# EAGLE design RF (EAGLE 9.6.2)

## Sheet 1 of 3: Board to Board Headers
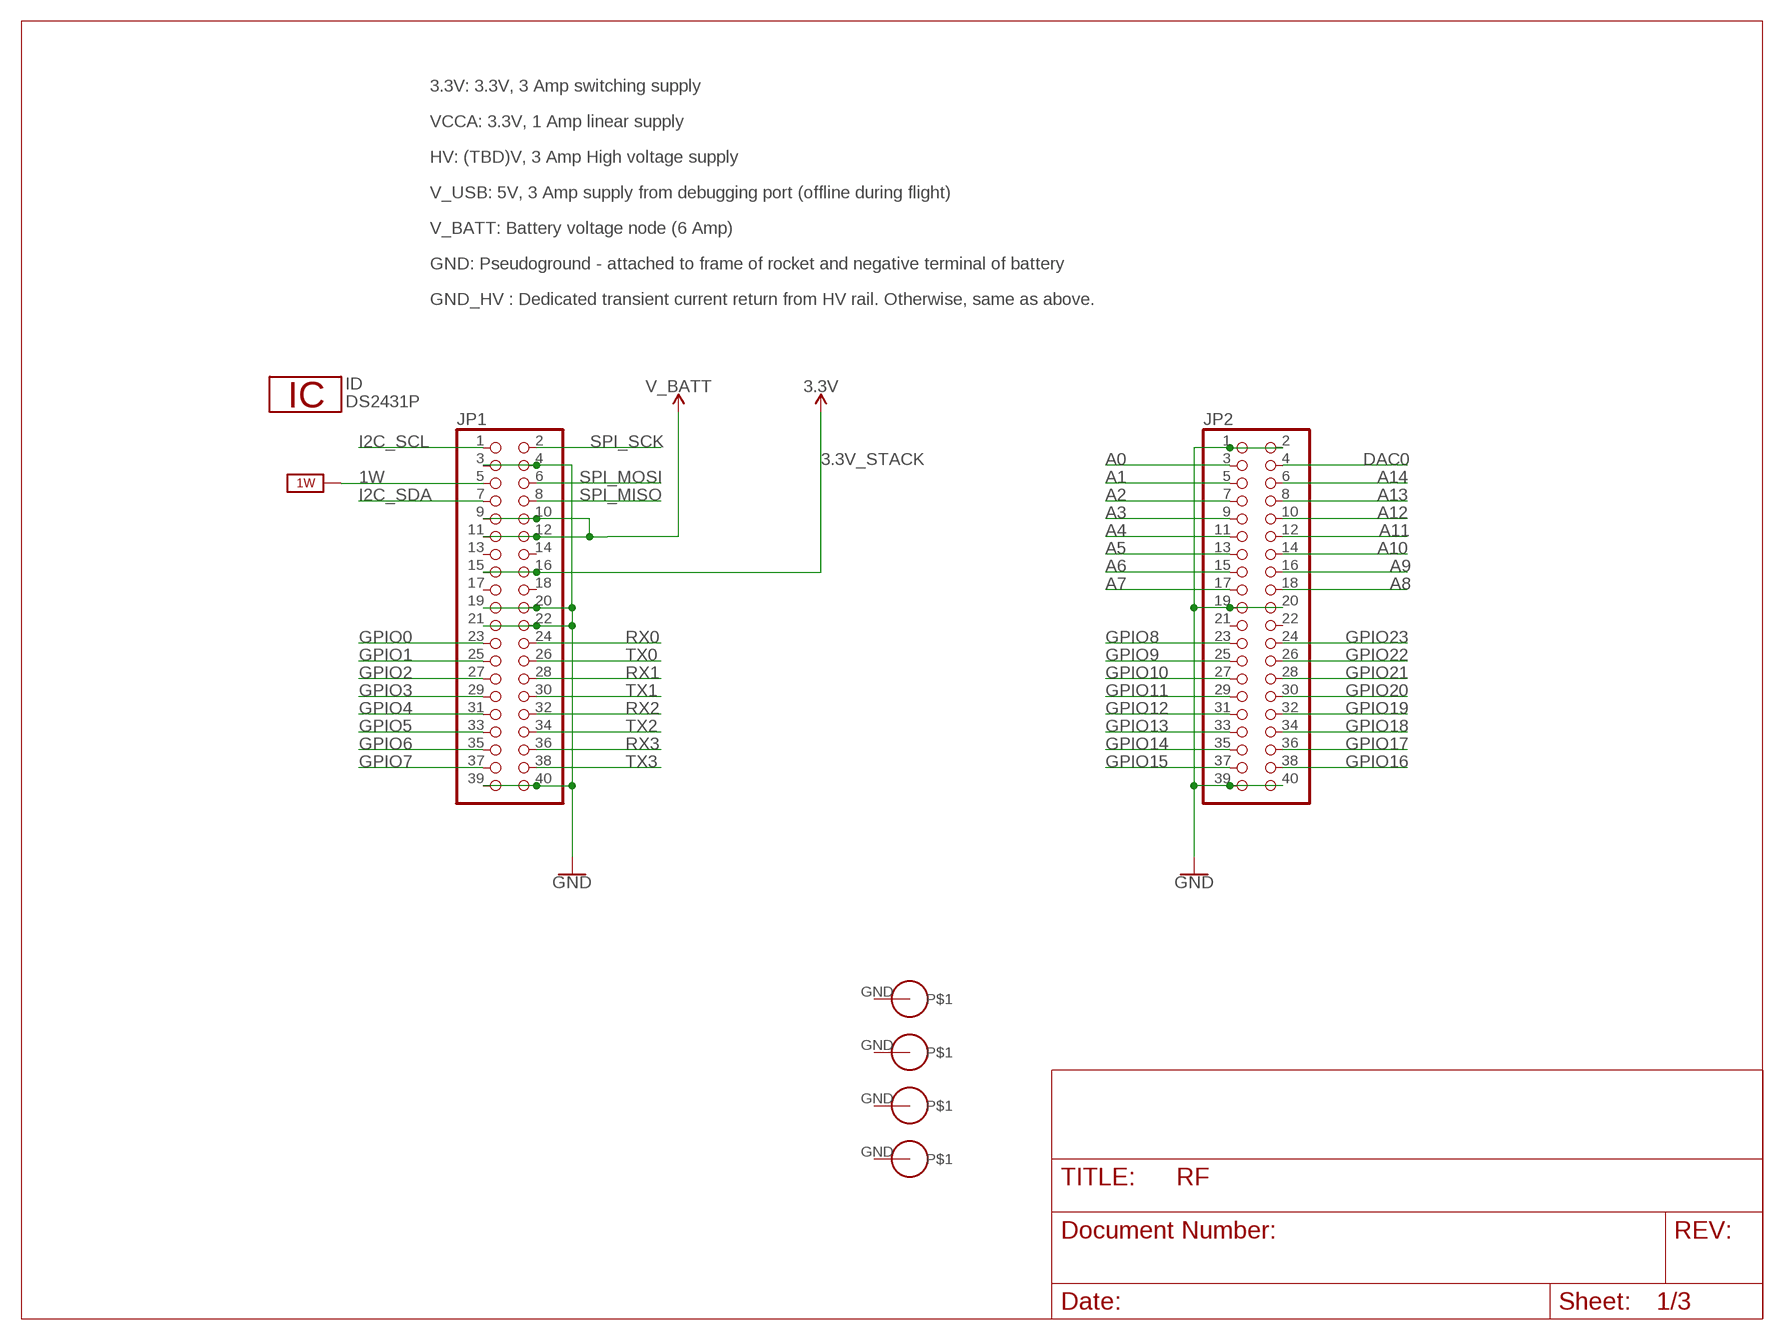
[diagram p0: schematic, sheet 1]

### Parts
ID  DS2431P  [TSOC6]
JP1  PINHD-2X20  [2X20]
JP2  PINHD-2X20  [2X20]
U$1  PS/104-MOUNTING-HOLE  [PC/104-MOUNTING-HOLE]
U$2  PS/104-MOUNTING-HOLE  [PC/104-MOUNTING-HOLE]
U$3  PS/104-MOUNTING-HOLE  [PC/104-MOUNTING-HOLE]
U$4  PS/104-MOUNTING-HOLE  [PC/104-MOUNTING-HOLE]

### Nets
1W: JP1.5 ; supply symbol labelled 1W_SUP
3.3V_STACK: JP1.15 JP1.16 ; supply symbol labelled 3.3V ; also sheet 2
A0: JP2.3
A1: JP2.5
A2: JP2.7
A3: JP2.9
A4: JP2.11
A5: JP2.13
A6: JP2.15
A7: JP2.17
A8: JP2.18
A9: JP2.16
A10: JP2.14
A11: JP2.12
A12: JP2.10
A13: JP2.8
A14: JP2.6
DAC0: JP2.4
GND: JP1.3 JP1.4 JP1.19 JP1.20 JP1.21 JP1.22 JP1.39 JP1.40 JP2.1 JP2.2 JP2.19 JP2.20 JP2.39 JP2.40 ; also sheet 2
GPIO0: JP1.23
GPIO1: JP1.25
GPIO2: JP1.27
GPIO3: JP1.29
GPIO4: JP1.31
GPIO5: JP1.33
GPIO6: JP1.35
GPIO7: JP1.37
GPIO8: JP2.23
GPIO9: JP2.25
GPIO10: JP2.27
GPIO11: JP2.29
GPIO12: JP2.31
GPIO13: JP2.33
GPIO14: JP2.35
GPIO15: JP2.37
GPIO16: JP2.38
GPIO17: JP2.36
GPIO18: JP2.34
GPIO19: JP2.32
GPIO20: JP2.30
GPIO21: JP2.28
GPIO22: JP2.26
GPIO23: JP2.24
I2C_SCL: JP1.1
I2C_SDA: JP1.7
N$4: JP1.9 JP1.10 JP1.11 JP1.12
RX0: JP1.24 ; also sheet 2
RX1: JP1.28 ; also sheet 2
RX2: JP1.32 ; also sheet 2
RX3: JP1.36
SPI_MISO: JP1.8
SPI_MOSI: JP1.6
SPI_SCK: JP1.2
TX0: JP1.26 ; also sheet 2
TX1: JP1.30 ; also sheet 2
TX2: JP1.34 ; also sheet 2
TX3: JP1.38
Unconnected: JP1.13 JP1.14 JP1.17 JP1.18 JP2.21 JP2.22 U$1.GND U$2.GND U$3.GND U$4.GND

### Notes on the sheet
- 3.3V: 3.3V, 3 Amp switching supply
- VCCA: 3.3V, 1 Amp linear supply
- HV: (TBD)V, 3 Amp High voltage supply
- V_USB: 5V, 3 Amp supply from debugging port (offline during flight)
- V_BATT: Battery voltage node (6 Amp)
- GND: Pseudoground - attached to frame of rocket and negative terminal of battery
- GND_HV : Dedicated transient current return from HV rail. Otherwise, same as above.

## Sheet 2 of 3: RN2483 434MHz RF module
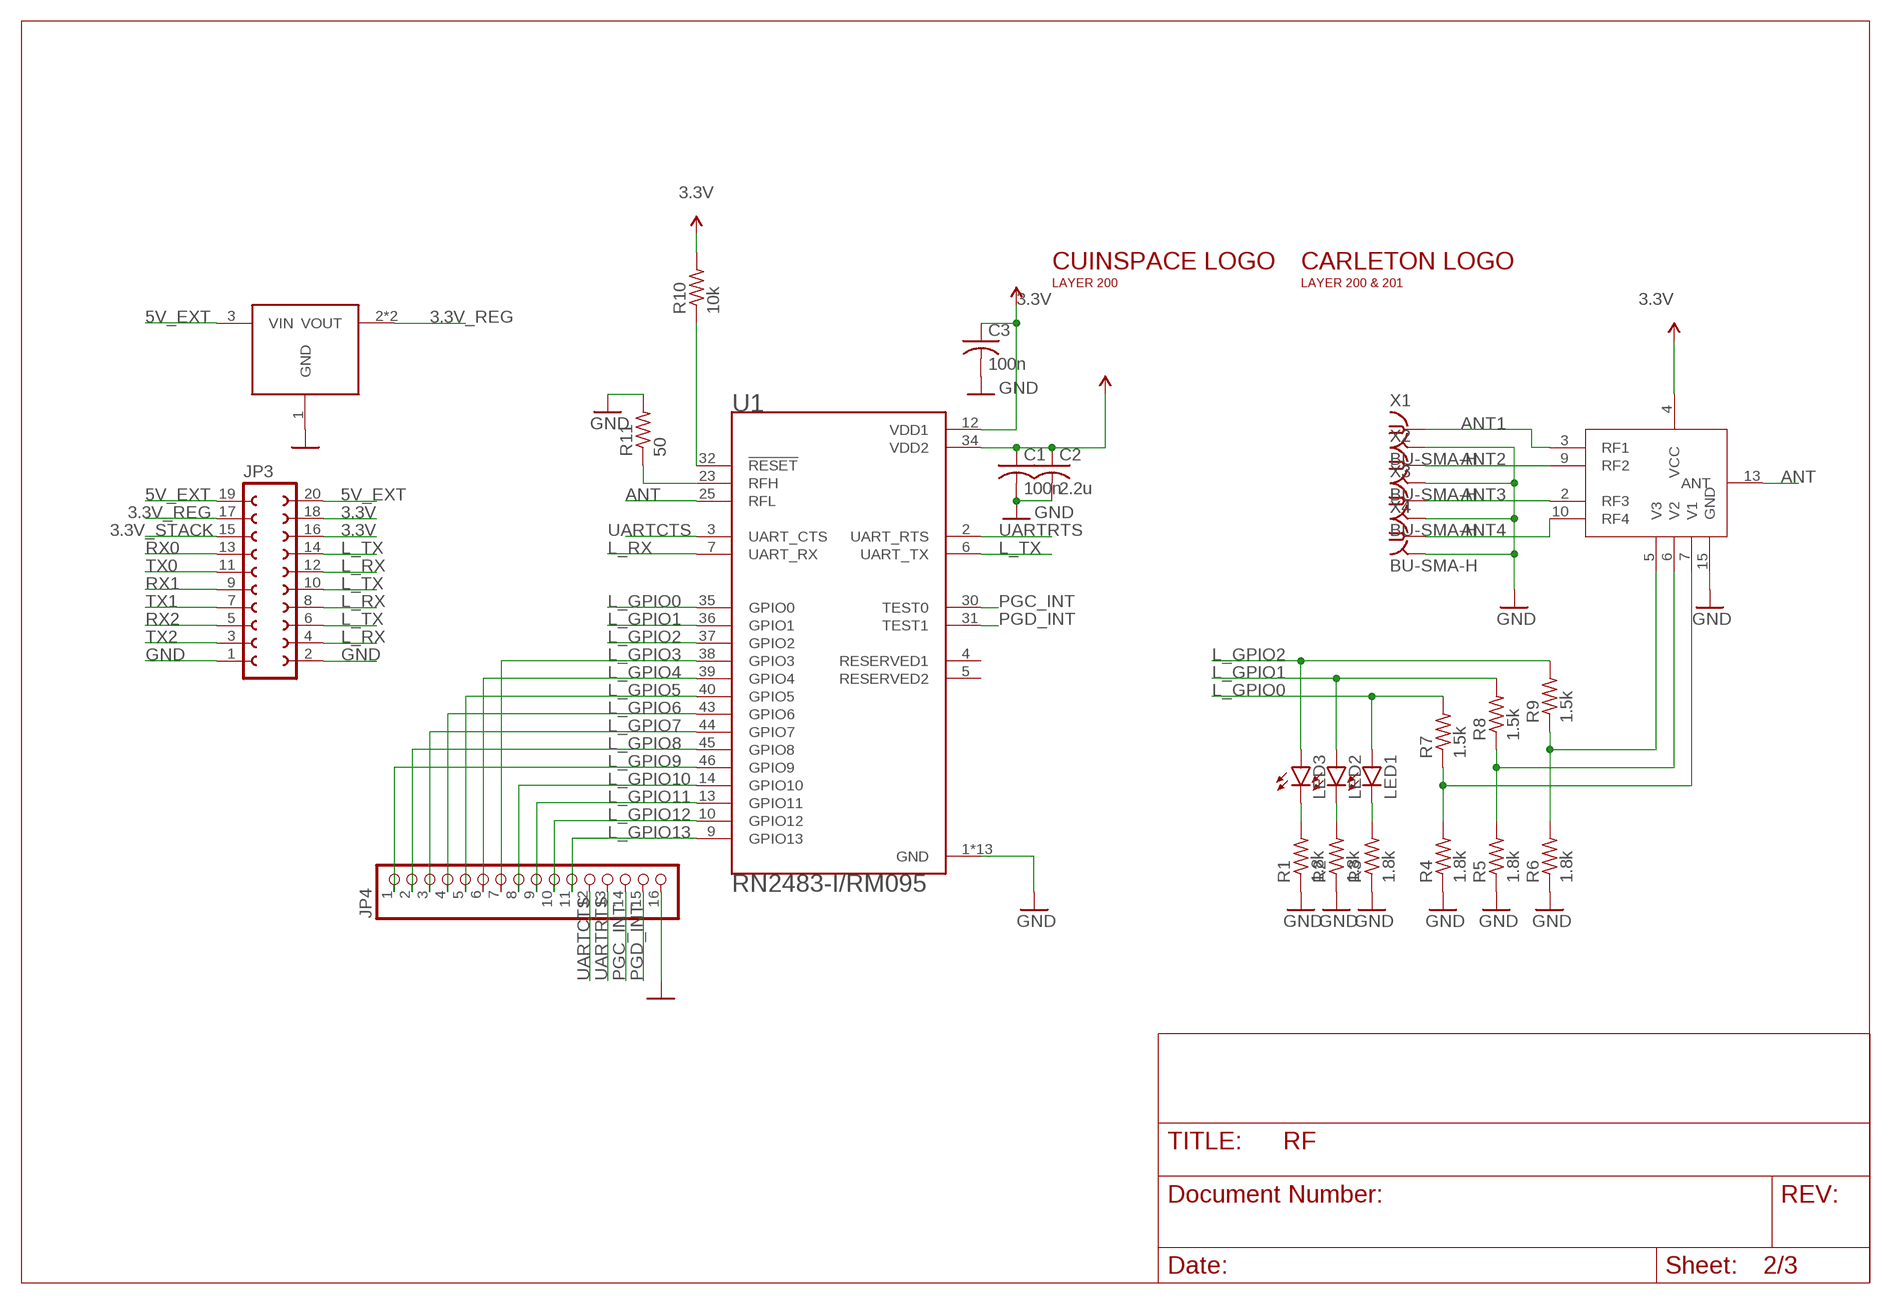
[diagram p1: schematic, sheet 2]

### Parts
C1  100n  C-USC0805  [C0805]
C2  2.2u  C-USC0805  [C0805]
C3  100n  C-USC0805  [C0805]
JP3  FE10-2  [FE10-2]
JP4  PINHD-1X16  [1X16]
LED1  LEDSMT1206  [1206]
LED2  LEDSMT1206  [1206]
LED3  LEDSMT1206  [1206]
R1  1.8k  R-US_R0805  [R0805]
R2  1.8k  R-US_R0805  [R0805]
R3  1.8k  R-US_R0805  [R0805]
R4  1.8k  R-US_R0805  [R0805]
R5  1.8k  R-US_R0805  [R0805]
R6  1.8k  R-US_R0805  [R0805]
R7  1.5k  R-US_R0805  [R0805]
R8  1.5k  R-US_R0805  [R0805]
R9  1.5k  R-US_R0805  [R0805]
R10  10k  R-US_R0805  [R0805]
R11  50  R-US_R0805  [R0805]
U1  RN2483-I/RM095  [MICROCHIP_RN2483-I/RM095]
U2  SKY13414  [QFN45P200X200X55-15N]
U3  LDL1117S33R  [SOT223]
U$6  INSPACE5CM_L  [INSPACE_5CM_LETTERS]
U$7  CARLETON3CM  [CARLETONU_3CM]
X1  BU-SMA-H  [BU-SMA-H]
X2  BU-SMA-H  [BU-SMA-H]
X3  BU-SMA-H  [BU-SMA-H]
X4  BU-SMA-H  [BU-SMA-H]

### Nets
3.3V: C1.1 C2.1 C3.1 JP3.16 JP3.18 R10.2 U1.12(VDD1) U1.34(VDD2) U2.4(VCC)
3.3V_REG: JP3.17 U3.2(VOUT) U3.4(VOUT)
3.3V_STACK: JP3.15 ; also sheet 1
5V_EXT: JP3.19 JP3.20 U3.3(VIN)
ANT: U1.25(RFL) U2.13(ANT)
ANT1: U2.3(RF1) X1.1
ANT2: U2.9(RF2) X2.1
ANT3: U2.2(RF3) X3.1
ANT4: U2.10(RF4) X4.1
GND: C1.2 C2.2 C3.2 JP3.1 JP3.2 JP4.16 R1.1 R2.1 R3.1 R4.1 R5.1 R6.1 R11.2 U1.1(GND) U1.8(GND) U1.11(GND) U1.20(GND) U1.21(GND) U1.22(GND) U1.24(GND) U1.26(GND) U1.27(GND) U1.28(GND) U1.33(GND) U1.41(GND) U1.47(GND) U2.15(GND) U3.1(GND) X1.2 X1.3 X1.4 X1.5 X2.2 X2.3 X2.4 X2.5 X3.2 X3.3 X3.4 X3.5 X4.2 X4.3 X4.4 X4.5 ; also sheet 1
L_GPIO0: LED1.A R7.2 U1.35(GPIO0)
L_GPIO1: LED2.A R8.2 U1.36(GPIO1)
L_GPIO2: LED3.A R9.2 U1.37(GPIO2)
L_GPIO3: JP4.7 U1.38(GPIO3)
L_GPIO4: JP4.6 U1.39(GPIO4)
L_GPIO5: JP4.5 U1.40(GPIO5)
L_GPIO6: JP4.4 U1.43(GPIO6)
L_GPIO7: JP4.3 U1.44(GPIO7)
L_GPIO8: JP4.2 U1.45(GPIO8)
L_GPIO9: JP4.1 U1.46(GPIO9)
L_GPIO10: JP4.8 U1.14(GPIO10)
L_GPIO11: JP4.9 U1.13(GPIO11)
L_GPIO12: JP4.10 U1.10(GPIO12)
L_GPIO13: JP4.11 U1.9(GPIO13)
L_RX: JP3.4 JP3.8 JP3.12 U1.7(UART_RX)
L_TX: JP3.6 JP3.10 JP3.14 U1.6(UART_TX)
N$1: R4.2 R7.1 U2.7(V1)
N$2: R5.2 R8.1 U2.6(V2)
N$3: R11.1 U1.23(RFH)
N$5: LED3.C R1.2
N$6: LED2.C R2.2
N$7: R6.2 R9.1 U2.5(V3)
N$9: R10.1 U1.32(!RESET)
N$11: LED1.C R3.2
PGC_INT: JP4.14 U1.30(TEST0)
PGD_INT: JP4.15 U1.31(TEST1)
RX0: JP3.13 ; also sheet 1
RX1: JP3.9 ; also sheet 1
RX2: JP3.5 ; also sheet 1
TX0: JP3.11 ; also sheet 1
TX1: JP3.7 ; also sheet 1
TX2: JP3.3 ; also sheet 1
UARTCTS: JP4.12 U1.3(UART_CTS)
UARTRTS: JP4.13 U1.2(UART_RTS)
Unconnected: U1.4(RESERVED1) U1.5(RESERVED2)

## Sheet 3 of 3: RN2903 903MHz RF module

## Power pins joined to a net without a drawn wire
1W: ID.2(1W)
GND: ID.1(GND)

## Library data of the parts
C1-C3 = rcl:C-US: CAPACITOR, American symbol; SPICEPREFIX: C
ID = 1wire:DS2431: 1024-Bit EEPROM This chip provides a 4x256 Bit EEPROM, which can be programmed@5V. Write protection and OTP emulation are available, too. Author: Jan Kandziora <jjj@gmx.de>
JP1 JP2 = pinhead:PINHD-2X20: PIN HEADER
JP3 = con-lsta:FE10-2: FEMALE HEADER; OC_FARNELL: unknown; OC_NEWARK: unknown
JP4 = pinhead:PINHD-1X16: PIN HEADER
LED1-LED3 = led:LED: LED OSRAM: - CHIPLED LG R971, LG N971, LY N971, LG Q971, LY Q971, LO R971, LY R971 LH N974, LH R974 LS Q976, LO Q976, LY Q976 LO Q996 - Hyper CHIPLED LW Q18S LB Q993, LB Q99A, LB R99A - SideLED LS A670, LO A670, LY A670, LG A670, LP A670 LB A673, LV A673, LT A673, LW A673 LH A674 LY A675 LS A676, LA A676, LO A676, LY A676, LW A676 LS A679, LY A679, LG A679 - Hyper Micro SIDELED® LS Y876, LA Y876, LO Y876, LY Y876 LT Y87S - SmartLED LW L88C, LW L88S LB L89C, LB L89S, LG L890 LS L89K, LO L89K, LY L89K LS L896, LA L896, LO L896, LY L896 - TOPLED LS T670, LO T670, LY T670, LG T670, LP T670 LSG T670, LSP T670, LSY T670, LOP T670, LYG T670 LG T671, LOG T671, LSG T671 LB T673, LV T673, LT T673, LW T673 LH T674 LS T676, LA T676, LO T676, LY T676, LB T676, LH T676, LSB T676, LW T676 LB T67C, LV T67C, LT T67C, LS T67K, LO T67K, LY T67K, LW E67C LS E67B, LA E67B, LO E67B, LY E67B, LB E67C, LV E67C, LT E67C LW T67C LS T679, LY T679, LG T679 LS T770, LO T770, LY T770, LG T770, LP T770 LB T773, LV T773, LT T773, LW T773 LH T774 LS E675, LA E675, LY E675, LS T675 LS T776, LA T776, LO T776, LY T776, LB T776 LHGB T686 LT T68C, LB T68C - Hyper Mini TOPLED® LB M676 - Mini TOPLED Santana® LG M470 LS M47K, LO M47K, LY M47K Source: http://www.osram.convergy.de LUXEON: - LUMILED® LXK2-PW12-R00, LXK2-PW12-S00, LXK2-PW14-U00, LXK2-PW14-V00 LXK2-PM12-R00, LXK2-PM12-S00, LXK2-PM14-U00 LXK2-PE12-Q00, LXK2-PE12-R00, LXK2-PE12-S00, LXK2-PE14-T00, LXK2-PE14-U00 LXK2-PB12-K00, LXK2-PB12-L00, LXK2-PB12-M00, LXK2-PB14-N00, LXK2-PB14-P00, LXK2-PB14-Q00 LXK2-PR12-L00, LXK2-PR12-M00, LXK2-PR14-Q00, LXK2-PR14-R00 LXK2-PD12-Q00, LXK2-PD12-R00, LXK2-PD12-S00 LXK2-PH12-R00, LXK2-PH12-S00 LXK2-PL12-P00, LXK2-PL12-Q00, LXK2-PL12-R00 Source: www.luxeon.com KINGBRIGHT: KA-3528ASYC Source: www.kingbright.com
R1-R11 = rcl:R-US_: RESISTOR, American symbol; SPICEPREFIX: R
U1 = RN2483-I_RM095:RN2483-I/RM095: Sub-GHz Dual Band Long Range Transceiver LoRa Module; AVAILABILITY: Unavailable; DESCRIPTION: Sub-GHz Dual Band Long Range Transceiver LoRa Module; MF: Microchip; MP: RN2483-I/RM095; PACKAGE: None; PRICE: None
U2 = CUINSPACE_Managed:SKY13414
U3 = CUINSPACE_Managed:LDL1117S33R
U$1-U$4 = CU inSpace 2019 Parts:PS/104-MOUNTING-HOLE: Mounting hole for PC/104 board.
U$6 = Logos:INSPACE
U$7 = Logos:CARLETON
X1-X4 = con-coax:BU-SMA-H: FEMALE SMA CONNECTOR Radiall; OC_FARNELL: unknown; OC_NEWARK: unknown

## Board
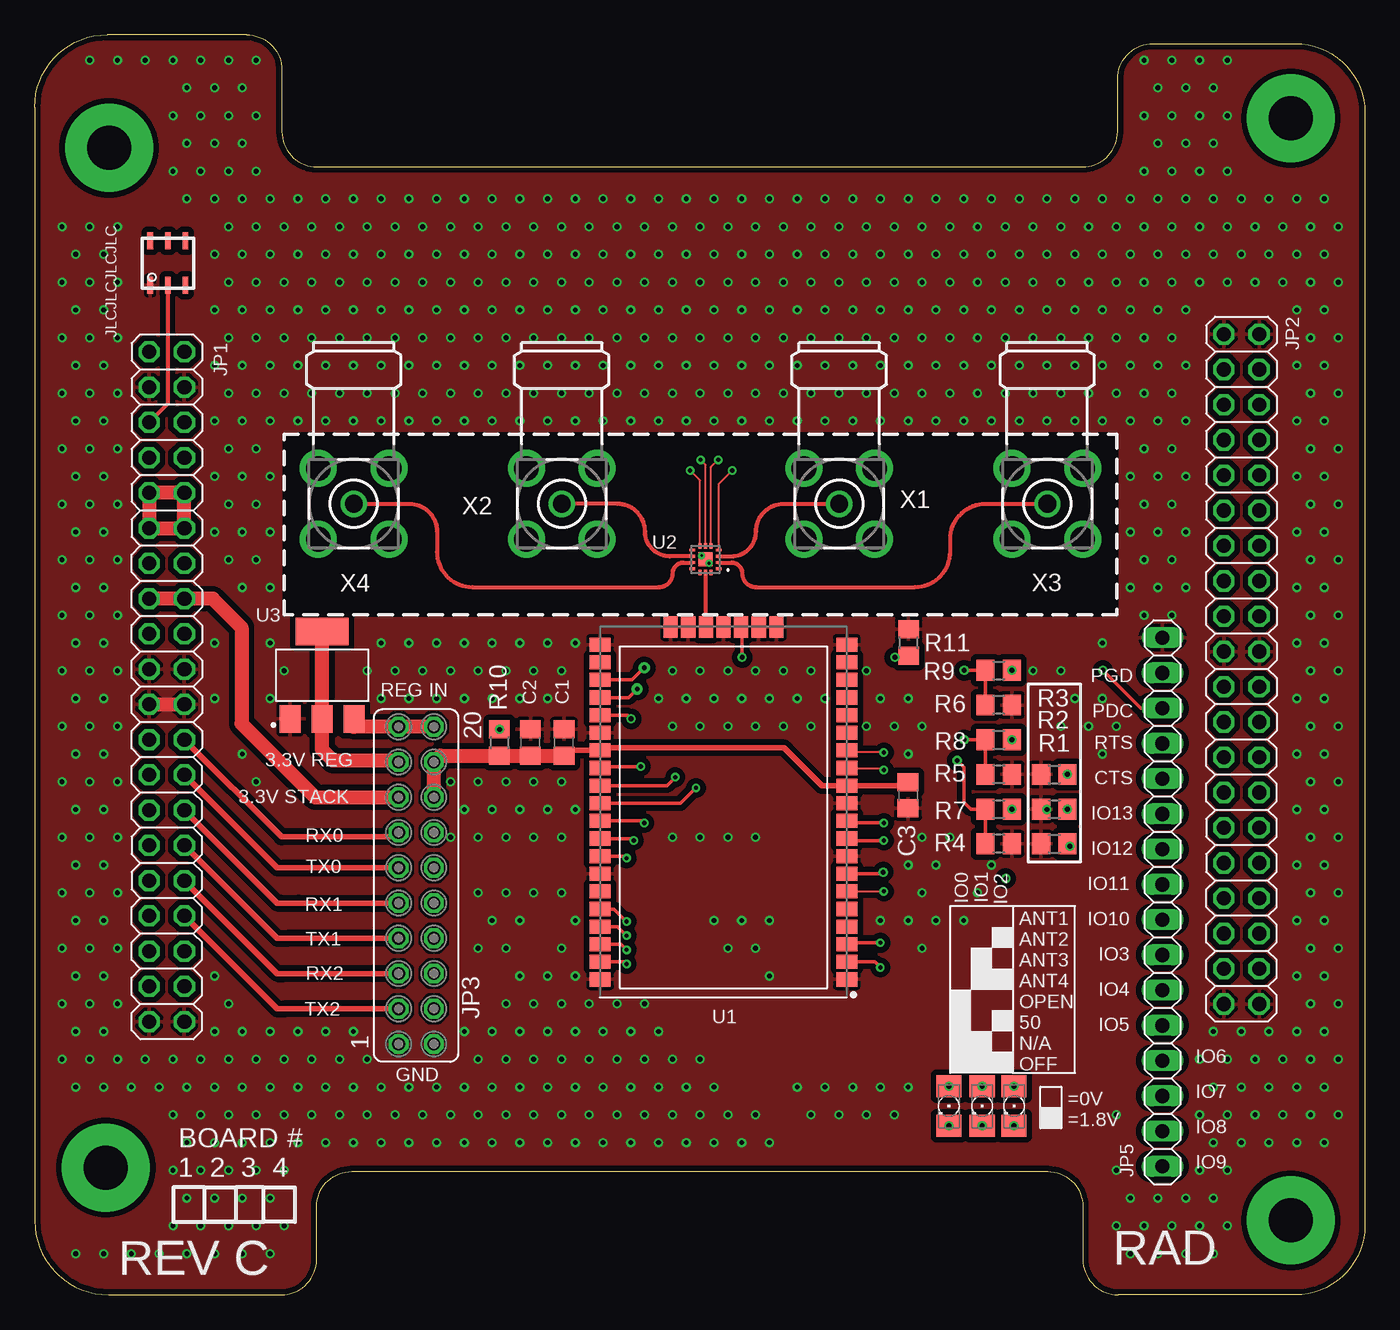
[diagram p2: board, top side]
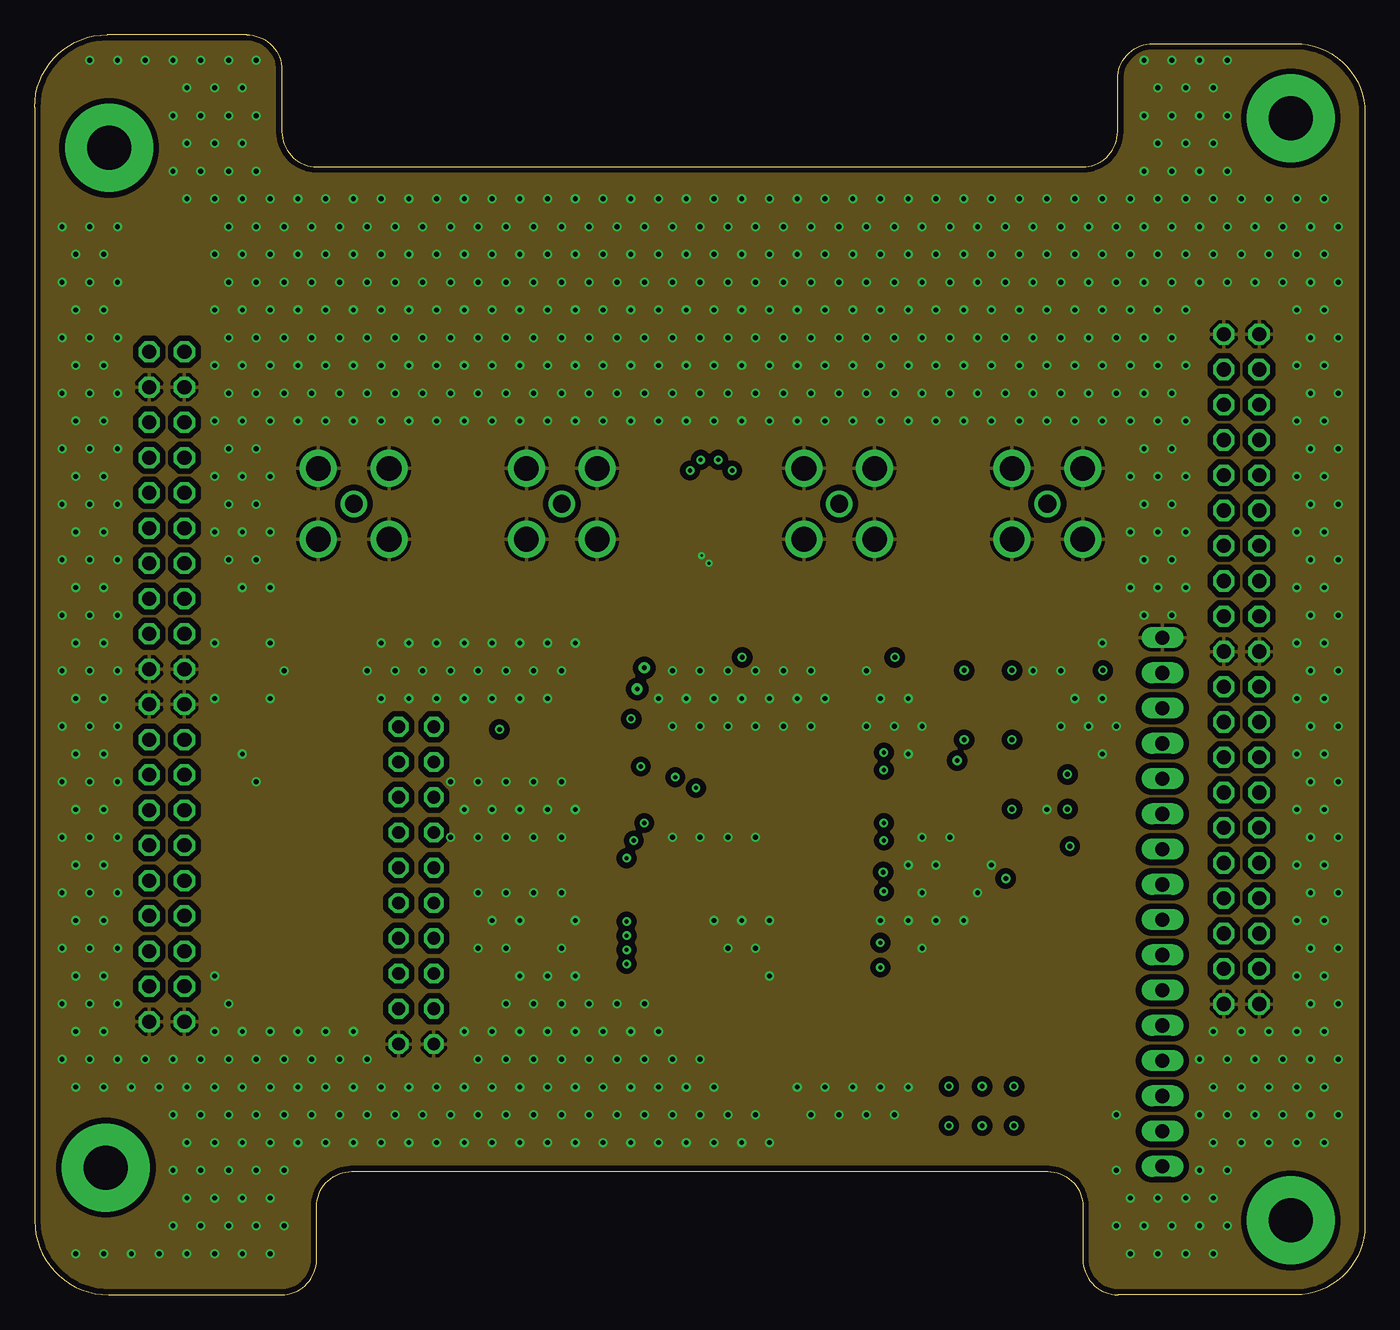
[diagram p3: board, inner layer Route2]
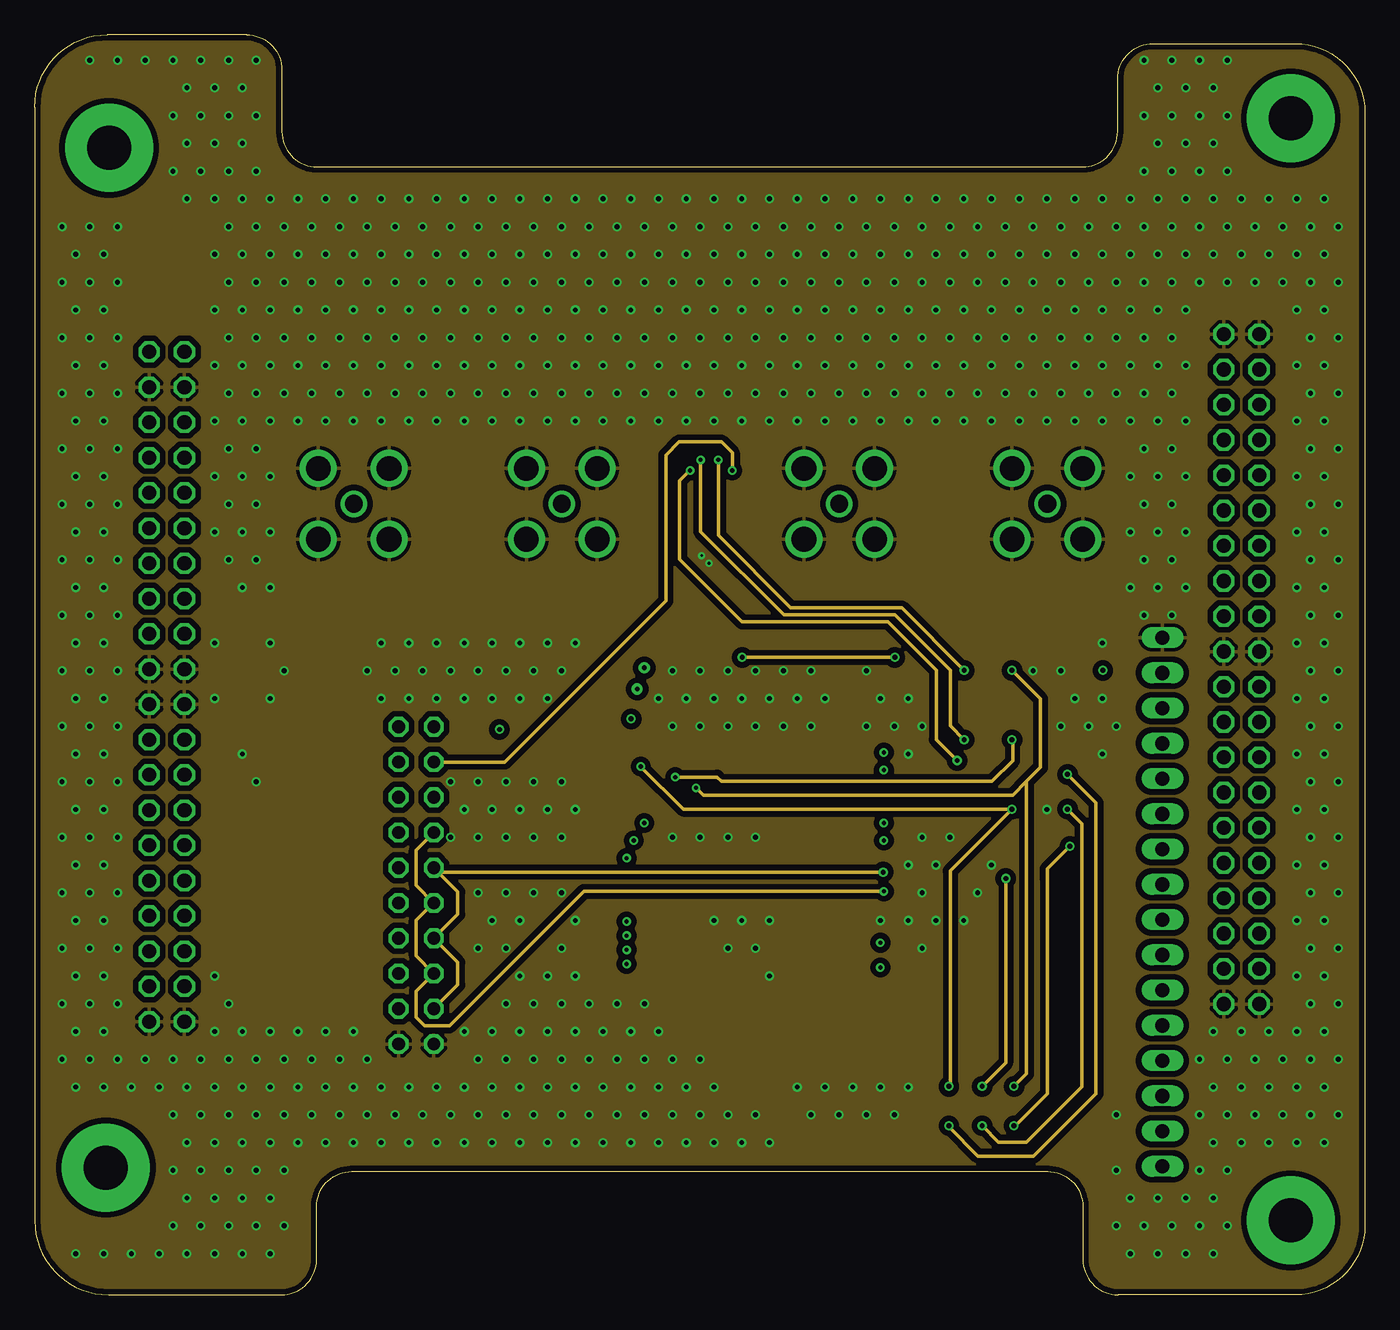
[diagram p4: board, inner layer Route15]
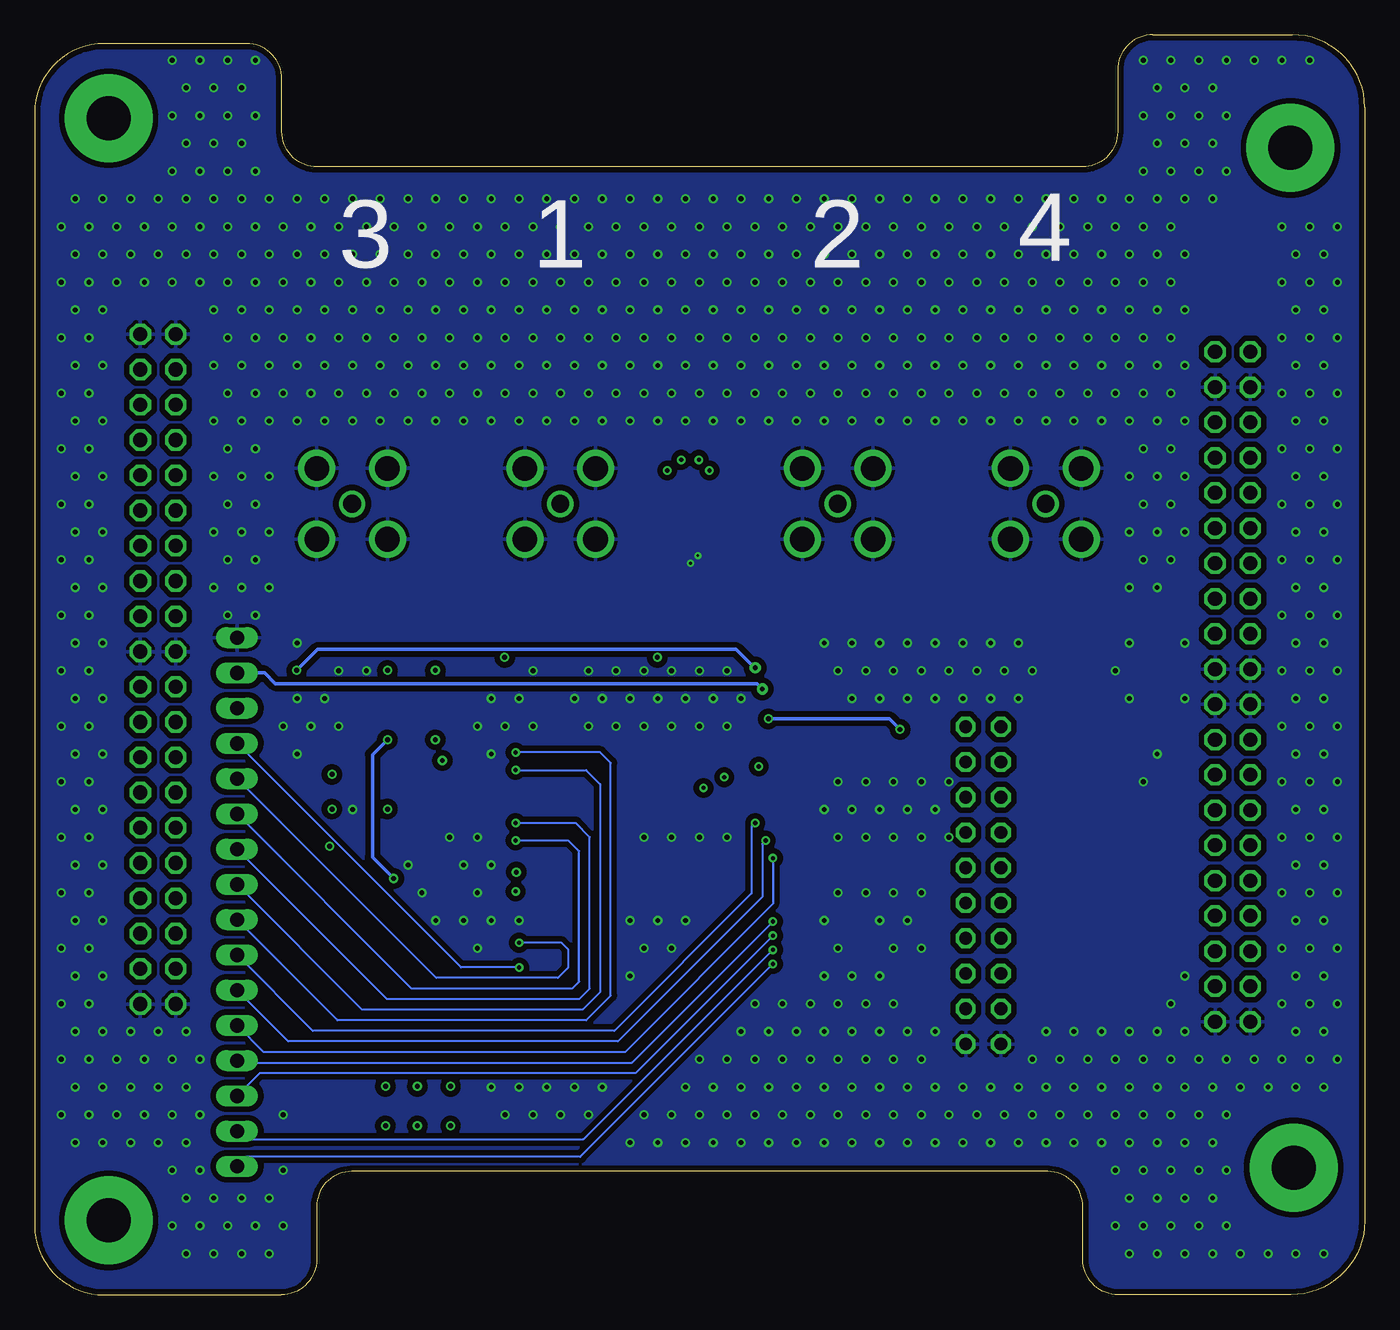
[diagram p5: board, bottom side, seen from below]

Size 95.89 x 90.81 mm. Coordinates in mm from the lower left corner, seen from the top.
Outline: 0,85.57 0,5.33 arc90 5.33,0 17.78,0 arc90 20.32,2.54 20.32,6.35 arc-90 22.86,8.89 73.03,8.89 arc-90 75.56,6.35 75.56,2.54 arc90 78.11,0 90.89,0 arc90 95.89,5 95.89,85.17 arc90 90.89,90.17 80.61,90.17 arc90 78.06,87.63 78.06,83.82 arc-90 75.53,81.28 20.36,81.28 arc-90 17.82,83.82 17.82,88.27 arc90 15.28,90.81 5.23,90.81 arc90 0,85.57
Copper layers (1+2*15+16): Top 0.035mm / dielectric 0.2mm / Route2 0.0175mm / dielectric 1.065mm / Route15 0.0175mm / dielectric 0.2mm / Bottom 0.035mm
Design rules "dirt_cheap_dirty_boards.v1 *": minimum track width 5mil, minimum drill 0.2mm, track to track 5mil, track to pad 5mil, pad to pad 5mil, via to via 5mil, smd to smd 0mil, copper to edge 10mil, drill to drill 10mil, minimum pad ring 10mil, minimum via ring 6mil, stop-mask expansion 2mil, vias tented up to drill 25mil, thermal gap 10mil

### Footprints (pad centres in the part's own frame; a part is rotated, then mirrored left to right if it is on the bottom)
C0805 = smd 1.3 x 1.5: 1 -0.95,0; 2 0.95,0
TSOC6 = smd 0.406 x 1.219: 1 -1.27,-1.6; 2 0,-1.6; 3 1.27,-1.6; 4 1.27,1.6; 5 0,1.6; 6 -1.27,1.6
2X20 = drill 1.016 octagon: 1 -24.13,-1.27; 2 -24.13,1.27; 3 -21.59,-1.27; 4 -21.59,1.27; 5 -19.05,-1.27; 6 -19.05,1.27; 7 -16.51,-1.27; 8 -16.51,1.27; 9 -13.97,-1.27; 10 -13.97,1.27; 11 -11.43,-1.27; 12 -11.43,1.27; 13 -8.89,-1.27; 14 -8.89,1.27; 15 -6.35,-1.27; 16 -6.35,1.27; 17 -3.81,-1.27; 18 -3.81,1.27; 19 -1.27,-1.27; 20 -1.27,1.27; 21 1.27,-1.27; 22 1.27,1.27; 23 3.81,-1.27; 24 3.81,1.27; 25 6.35,-1.27; 26 6.35,1.27; 27 8.89,-1.27; 28 8.89,1.27; 29 11.43,-1.27; 30 11.43,1.27; 31 13.97,-1.27; 32 13.97,1.27; 33 16.51,-1.27; 34 16.51,1.27; 35 19.05,-1.27; 36 19.05,1.27; 37 21.59,-1.27; 38 21.59,1.27; 39 24.13,-1.27; 40 24.13,1.27
FE10-2 = drill 0.914 octagon: 1 -11.43,1.27; 2 -11.43,-1.27; 3 -8.89,1.27; 4 -8.89,-1.27; 5 -6.35,1.27; 6 -6.35,-1.27; 7 -3.81,1.27; 8 -3.81,-1.27; 9 -1.27,1.27; 10 -1.27,-1.27; 11 1.27,1.27; 12 1.27,-1.27; 13 3.81,1.27; 14 3.81,-1.27; 15 6.35,1.27; 16 6.35,-1.27; 17 8.89,1.27; 18 8.89,-1.27; 19 11.43,1.27; 20 11.43,-1.27
1X16 = drill 1.016 long: 1 -19.05,0; 2 -16.51,0; 3 -13.97,0; 4 -11.43,0; 5 -8.89,0; 6 -6.35,0; 7 -3.81,0; 8 -1.27,0; 9 1.27,0; 10 3.81,0; 11 6.35,0; 12 8.89,0; 13 11.43,0; 14 13.97,0; 15 16.51,0; 16 19.05,0
1206 = smd 1.6 x 1.803: A -1.422,0; C 1.422,0
R0805 = smd 1.3 x 1.5: 1 -0.95,0; 2 0.95,0
MICROCHIP_RN2483-I/RM095 = smd 1.524 x 1.016: 1 -8.89,12.065; 2 -8.89,10.795; 3 -8.89,9.525; 4 -8.89,8.255; 5 -8.89,6.985; 6 -8.89,5.715; 7 -8.89,4.445; 8 -8.89,3.175; 9 -8.89,1.905; 10 -8.89,0.635; 11 -8.89,-0.635; 12 -8.89,-1.905; 13 -8.89,-3.175; 14 -8.89,-4.445; 15 -8.89,-5.715; 16 -8.89,-6.985; 17 -8.89,-8.255; 18 -8.89,-9.525; 19 -8.89,-10.795; 20 -8.89,-12.065; 28 8.89,-12.065; 29 8.89,-10.795; 30 8.89,-9.525; 31 8.89,-8.255; 32 8.89,-6.985; 33 8.89,-5.715; 34 8.89,-4.445; 35 8.89,-3.175; 36 8.89,-1.905; 37 8.89,-0.635; 38 8.89,0.635; 39 8.89,1.905; 40 8.89,3.175; 41 8.89,4.445; 42 8.89,5.715; 43 8.89,6.985; 44 8.89,8.255; 45 8.89,9.525; 46 8.89,10.795; 47 8.89,12.065 | smd 1.016 x 1.524: 21 -3.81,-13.335; 22 -2.54,-13.335; 23 -1.27,-13.335; 24 0,-13.335; 25 1.27,-13.335; 26 2.54,-13.335; 27 3.81,-13.335
QFN45P200X200X55-15N = smd 0.2 x 0.395: 1 -0.675,-0.953; 2 -0.225,-0.953; 3 0.225,-0.953; 4 0.675,-0.953; 8 0.675,0.953; 9 0.225,0.953; 10 -0.225,0.953; 11 -0.675,0.953 | smd 0.395 x 0.2: 5 0.953,-0.4; 6 0.953,0; 7 0.953,0.4; 12 -0.953,0.4; 13 -0.953,0; 14 -0.953,-0.4 | smd 1 x 1: 15 0,0
SOT223 = smd 1.5 x 2: 1 -2.3,-3.15; 2 0,-3.15; 3 2.3,-3.15 | smd 3.8 x 2: 4 0,3.15
PC/104-MOUNTING-HOLE = drill 3.175 pad 6.35: GND 0,0
BU-SMA-H = drill 1.27: 1 0,0 | drill 1.778: 2 -2.55,2.55; 3 2.55,2.55; 4 2.55,-2.55; 5 -2.55,-2.55

### Placement (x,y rotation side)
C1  38.15,39.79 90 top
C2  35.73,39.8 90 top
C3  62.96,36 270 top
ID  9.6,74.35 0 top
JP1  9.53,43.81 270 top
JP2  87,45.09 270 top
JP3  27.5,29.5 90 top
JP4  81.3,28.3 90 top
LED1  65.9,13.6 270 top
LED2  68.3,13.6 270 top
LED3  70.6,13.6 270 top
R1  73.5,32.5 0 top
R2  73.5,35 0 top
R3  73.5,37.5 0 top
R4  69.5,32.5 180 top
R5  69.5,37.5 180 top
R6  69.5,42.5 180 top
R7  69.5,35 0 top
R8  69.5,40 0 top
R9  69.5,45 0 top
R10  33.5,39.79 270 top
R11  63,47 90 top
U1  49.65,34.79 180 top
U2  48.36,52.99 90 top
U3  20.72,44.65 0 top
U$1  5.36,82.65 0 top
U$2  90.55,84.79 0 top
U$3  5.13,9.17 0 top
U$4  90.55,5.36 0 top
U$6  23,73 0 top
U$7  32,11 0 top
X1  58,57 90 top
X2  38,57 90 top
X3  73,57 90 top
X4  23,57 90 top

### Tracks (layer width: path | path; a pad name or v marks a point on that pad's centre or on a via)
1W
  Top 0.305: ID.2 9.6,64.21 JP1.5
3.3V  (via drill 0.3 pad 0.45)
  Top 0.127: U2.4 49.31,58.43 v50.29,59.41
  Top 0.305: 58,36.69 U1.12
  Top 0.406: C3.1 62.7,36.69 58,36.69 56.75,36.69 54.03,39.41 40.94,39.41 U1.34 38.54,39.23 C1.1
  Top 1.016: JP3.16 JP3.18 29.23,38.85 33.49,38.85 R10.2 C2.1 35.74,38.84 C1.1
  Route15 0.127: 50.29,59.5 v50.29,59.41
  Route15 0.254: JP3.18 33.89,38.39 45.5,50 45.5,60.5 46.45,61.45 49.51,61.45 50.29,60.67 50.29,59.5
3.3V_REG
  Top 1.016: JP3.17 26.12,38.5 21.5,38.5 20.72,39.28 U3.2 U3.4
3.3V_STACK
  Top 1.016: JP3.15 20.23,35.85 14.91,41.16 14.91,48.09 12.84,50.16 JP1.16 10,50.16 JP1.15
5V_EXT
  Top 1.016: JP3.20 JP3.19 23.02,40.93 U3.3
ANT
  Top 0.293: 48.36,48.14 arc90 U1.25 48.36,48.14
  Top 0.3: U2.13 48.36,48.14 arc90 U1.25
ANT1
  Top 0.3: U2.3 50.22,53.22 arc90 52,55 arc-90 54,57 X1.1
ANT2
  Top 0.3: U2.9 45.78,53.22 arc-90 44,55 arc90 42,57 X2.1
ANT3
  Top 0.3: U2.2 50.23,52.77 arc-90 51,52 arc90 52,51 63.46,51 arc90 66,53.54 66,54.46 arc-90 68.54,57 X3.1
ANT4
  Top 0.3: X4.1 27,57 arc-90 29,55 29,53.54 arc90 31.54,51 45,51 arc90 46,52 arc-90 46.77,52.77 U2.10
GND  (via drill 0.2 pad 0.45, 0.35)
  Top 0.127: U2.15 48.62,52.74 v48.62,52.71
  Top 1.016: JP1.21 JP1.22
  other vias: 48.08,53.27 1.97,16.97 1.97,20.97 1.97,24.97 1.97,28.97 1.97,32.97 1.97,36.97 1.97,40.97 1.97,44.97 1.97,48.97 1.97,52.97 1.97,56.97 1.97,60.97 1.97,64.97 1.97,68.97 1.97,72.97 1.97,76.97 2.97,2.97 2.97,14.97 3.97,16.97 2.97,18.97 3.97,20.97 2.97,22.97 3.97,24.97 2.97,26.97 3.97,28.97 2.97,30.97 3.97,32.97 2.97,34.97 3.97,36.97 2.97,38.97 3.97,40.97 2.97,42.97 3.97,44.97 2.97,46.97 3.97,48.97 2.97,50.97 3.97,52.97 2.97,54.97 3.97,56.97 2.97,58.97 3.97,60.97 2.97,62.97 3.97,64.97 2.97,66.97 3.97,68.97 2.97,70.97 3.97,72.97 2.97,74.97 3.97,76.97 3.97,88.97 4.97,2.97 4.97,14.97 5.97,16.97 4.97,18.97 5.97,20.97 4.97,22.97 5.97,24.97 4.97,26.97 5.97,28.97 4.97,30.97 5.97,32.97 4.97,34.97 5.97,36.97 4.97,38.97 5.97,40.97 4.97,42.97 5.97,44.97 4.97,46.97 5.97,48.97 4.97,50.97 5.97,52.97 4.97,54.97 5.97,56.97 4.97,58.97 5.97,60.97 4.97,62.97 5.97,64.97 4.97,66.97 5.97,68.97 4.97,70.97 5.97,72.97 4.97,74.97 5.97,76.97 5.97,88.97 6.97,2.97 6.97,14.97 7.97,16.97 7.97,88.97 8.97,2.97 9.97,4.97 9.97,8.97 9.97,12.97 8.97,14.97 9.97,16.97 9.97,80.97 9.97,84.97 9.97,88.97 10.97,2.97 11.97,4.97 10.97,6.97 11.97,8.97 10.97,10.97 11.97,12.97 10.97,14.97 11.97,16.97 10.97,78.97 11.97,80.97 10.97,82.97 11.97,84.97 10.97,86.97 11.97,88.97 12.97,2.97 13.97,4.97 12.97,6.97 13.97,8.97 12.97,10.97 13.97,12.97 12.97,14.97 13.97,16.97 12.97,18.97 13.97,20.97 12.97,22.97 12.97,42.97 12.97,46.97 13.97,52.97 12.97,54.97 13.97,56.97 12.97,58.97 13.97,60.97 12.97,62.97 13.97,64.97 12.97,66.97 13.97,68.97 12.97,70.97 13.97,72.97 12.97,74.97 13.97,76.97 12.97,78.97 13.97,80.97 12.97,82.97 13.97,84.97 12.97,86.97 13.97,88.97 14.97,2.97 15.97,4.97 14.97,6.97 15.97,8.97 14.97,10.97 15.97,12.97 14.97,14.97 15.97,16.97 14.97,18.97 15.97,36.97 14.97,38.97 14.97,50.97 15.97,52.97 14.97,54.97 15.97,56.97 14.97,58.97 15.97,60.97 14.97,62.97 15.97,64.97 14.97,66.97 15.97,68.97 14.97,70.97 15.97,72.97 14.97,74.97 15.97,76.97 14.97,78.97 15.97,80.97 14.97,82.97 15.97,84.97 14.97,86.97 15.97,88.97 16.97,2.97 17.97,4.97 16.97,6.97 17.97,8.97 16.97,10.97 17.97,12.97 16.97,14.97 17.97,16.97 16.97,18.97 16.97,42.97 17.97,44.97 16.97,46.97 16.97,50.97 16.97,54.97 16.97,58.97 16.97,62.97 17.97,64.97 16.97,66.97 17.97,68.97 16.97,70.97 17.97,72.97 16.97,74.97 17.97,76.97 16.97,78.97 18.97,10.97 19.97,12.97 18.97,14.97 19.97,16.97 18.97,18.97 18.97,62.97 19.97,64.97 18.97,66.97 19.97,68.97 18.97,70.97 19.97,72.97 18.97,74.97 19.97,76.97 18.97,78.97 20.97,10.97 21.97,12.97 20.97,14.97 21.97,16.97 20.97,18.97 20.97,62.97 21.97,64.97 20.97,66.97 21.97,68.97 20.97,70.97 21.97,72.97 20.97,74.97 21.97,76.97 20.97,78.97 22.97,10.97 23.97,12.97 22.97,14.97 23.97,16.97 22.97,18.97 23.97,44.97 22.97,62.97 23.97,64.97 22.97,66.97 23.97,68.97 22.97,70.97 23.97,72.97 22.97,74.97 23.97,76.97 22.97,78.97 24.97,10.97 25.97,12.97 24.97,14.97 24.97,42.97 25.97,44.97 24.97,46.97 24.97,62.97 25.97,64.97 24.97,66.97 25.97,68.97 24.97,70.97 25.97,72.97 24.97,74.97 25.97,76.97 24.97,78.97 26.97,10.97 27.97,12.97 26.97,14.97 26.97,42.97 27.97,44.97 26.97,46.97 26.97,62.97 27.97,64.97 26.97,66.97 27.97,68.97 26.97,70.97 27.97,72.97 26.97,74.97 27.97,76.97 26.97,78.97 28.97,10.97 29.97,12.97 28.97,14.97 29.97,32.97 29.97,36.97 28.97,42.97 29.97,44.97 28.97,46.97 28.97,62.97 29.97,64.97 28.97,66.97 29.97,68.97 28.97,70.97 29.97,72.97 28.97,74.97 29.97,76.97 28.97,78.97 30.97,10.97 31.97,12.97 30.97,14.97 31.97,16.97 30.97,18.97 31.97,24.97 31.97,28.97 31.97,32.97 30.97,34.97 31.97,36.97 30.97,42.97 31.97,44.97 30.97,46.97 30.97,62.97 31.97,64.97 30.97,66.97 31.97,68.97 30.97,70.97 31.97,72.97 30.97,74.97 31.97,76.97 30.97,78.97 32.97,10.97 33.97,12.97 32.97,14.97 33.97,16.97 32.97,18.97 33.97,20.97 33.97,24.97 32.97,26.97 33.97,28.97 33.97,32.97 32.97,34.97 33.97,36.97 32.97,42.97 33.97,44.97 32.97,46.97 32.97,62.97 33.97,64.97 32.97,66.97 33.97,68.97 32.97,70.97 33.97,72.97 32.97,74.97 33.97,76.97 32.97,78.97 34.97,10.97 35.97,12.97 34.97,14.97 35.97,16.97 34.97,18.97 35.97,20.97 34.97,22.97 34.97,26.97 35.97,28.97 35.97,32.97 34.97,34.97 35.97,36.97 34.97,42.97 35.97,44.97 34.97,46.97 34.97,62.97 35.97,64.97 34.97,66.97 35.97,68.97 34.97,70.97 35.97,72.97 34.97,74.97 35.97,76.97 34.97,78.97 36.97,10.97 37.97,12.97 36.97,14.97 37.97,16.97 36.97,18.97 37.97,20.97 36.97,22.97 37.97,24.97 37.97,28.97 37.97,32.97 36.97,34.97 37.97,36.97 36.97,42.97 37.97,44.97 36.97,46.97 36.97,62.97 37.97,64.97 36.97,66.97 37.97,68.97 36.97,70.97 37.97,72.97 36.97,74.97 37.97,76.97 36.97,78.97 38.97,10.97 39.97,12.97 38.97,14.97 39.97,16.97 38.97,18.97 39.97,20.97 38.97,22.97 38.97,26.97 38.97,34.97 38.97,46.97 38.97,62.97 39.97,64.97 38.97,66.97 39.97,68.97 38.97,70.97 39.97,72.97 38.97,74.97 39.97,76.97 38.97,78.97 40.97,10.97 41.97,12.97 40.97,14.97 41.97,16.97 40.97,18.97 41.97,20.97 40.97,62.97 41.97,64.97 40.97,66.97 41.97,68.97 40.97,70.97 41.97,72.97 40.97,74.97 41.97,76.97 40.97,78.97 42.97,10.97 43.97,12.97 42.97,14.97 43.97,16.97 42.97,18.97 43.97,20.97 42.97,62.97 43.97,64.97 42.97,66.97 43.97,68.97 42.97,70.97 43.97,72.97 42.97,74.97 43.97,76.97 42.97,78.97 44.97,10.97 45.97,12.97 44.97,14.97 45.97,16.97 44.97,18.97 45.97,32.97 45.97,40.97 44.97,42.97 45.97,44.97 44.97,62.97 45.97,64.97 44.97,66.97 45.97,68.97 44.97,70.97 45.97,72.97 44.97,74.97 45.97,76.97 44.97,78.97 46.97,10.97 47.97,12.97 46.97,14.97 47.97,16.97 47.97,32.97 47.97,40.97 46.97,42.97 47.97,44.97 46.97,62.97 47.97,64.97 46.97,66.97 47.97,68.97 46.97,70.97 47.97,72.97 46.97,74.97 47.97,76.97 46.97,78.97 48.97,10.97 49.97,12.97 48.97,14.97 49.97,24.97 48.97,26.97 49.97,32.97 49.97,40.97 48.97,42.97 49.97,44.97 48.97,62.97 49.97,64.97 48.97,66.97 49.97,68.97 48.97,70.97 49.97,72.97 48.97,74.97 49.97,76.97 48.97,78.97 50.97,10.97 51.97,12.97 51.97,24.97 50.97,26.97 51.97,32.97 51.97,40.97 50.97,42.97 51.97,44.97 50.97,62.97 51.97,64.97 50.97,66.97 51.97,68.97 50.97,70.97 51.97,72.97 50.97,74.97 51.97,76.97 50.97,78.97 52.97,10.97 52.97,22.97 52.97,26.97 53.97,40.97 52.97,42.97 53.97,44.97 52.97,62.97 53.97,64.97 52.97,66.97 53.97,68.97 52.97,70.97 53.97,72.97 52.97,74.97 53.97,76.97 52.97,78.97 55.97,12.97 54.97,14.97 55.97,40.97 54.97,42.97 55.97,44.97 54.97,62.97 55.97,64.97 54.97,66.97 55.97,68.97 54.97,70.97 55.97,72.97 54.97,74.97 55.97,76.97 54.97,78.97 57.97,12.97 56.97,14.97 56.97,42.97 56.97,62.97 57.97,64.97 56.97,66.97 57.97,68.97 56.97,70.97 57.97,72.97 56.97,74.97 57.97,76.97 56.97,78.97 59.97,12.97 58.97,14.97 59.97,40.97 59.97,44.97 58.97,62.97 59.97,64.97 58.97,66.97 59.97,68.97 58.97,70.97 59.97,72.97 58.97,74.97 59.97,76.97 58.97,78.97 61.97,12.97 60.97,14.97 60.97,26.97 61.97,40.97 60.97,42.97 60.97,62.97 61.97,64.97 60.97,66.97 61.97,68.97 60.97,70.97 61.97,72.97 60.97,74.97 61.97,76.97 60.97,78.97 62.97,14.97 63.97,24.97 62.97,26.97 63.97,28.97 62.97,30.97 63.97,32.97 62.97,38.97 63.97,40.97 62.97,42.97 62.97,62.97 63.97,64.97 62.97,66.97 63.97,68.97 62.97,70.97 63.97,72.97 62.97,74.97 63.97,76.97 62.97,78.97 64.97,26.97 64.97,30.97 65.97,32.97 64.97,62.97 65.97,64.97 64.97,66.97 65.97,68.97 64.97,70.97 65.97,72.97 64.97,74.97 65.97,76.97 64.97,78.97 66.97,26.97 67.97,28.97 66.97,62.97 67.97,64.97 66.97,66.97 67.97,68.97 66.97,70.97 67.97,72.97 66.97,74.97 67.97,76.97 66.97,78.97 68.97,30.97 68.97,62.97 69.97,64.97 68.97,66.97 69.97,68.97 68.97,70.97 69.97,72.97 68.97,74.97 69.97,76.97 68.97,78.97 71.97,44.97 70.97,62.97 71.97,64.97 70.97,66.97 71.97,68.97 70.97,70.97 71.97,72.97 70.97,74.97 71.97,76.97 70.97,78.97 72.97,34.97 73.97,40.97 73.97,44.97 72.97,62.97 73.97,64.97 72.97,66.97 73.97,68.97 72.97,70.97 73.97,72.97 72.97,74.97 73.97,76.97 72.97,78.97 75.97,40.97 74.97,42.97 74.97,62.97 75.97,64.97 74.97,66.97 75.97,68.97 74.97,70.97 75.97,72.97 74.97,74.97 75.97,76.97 74.97,78.97 77.97,4.97 77.97,8.97 77.97,12.97 76.97,38.97 77.97,40.97 76.97,42.97 76.97,46.97 76.97,62.97 77.97,64.97 76.97,66.97 77.97,68.97 76.97,70.97 77.97,72.97 76.97,74.97 77.97,76.97 76.97,78.97 78.97,2.97 79.97,4.97 78.97,6.97 79.97,48.97 78.97,50.97 79.97,52.97 78.97,54.97 79.97,56.97 78.97,58.97 79.97,60.97 78.97,62.97 79.97,64.97 78.97,66.97 79.97,68.97 78.97,70.97 79.97,72.97 78.97,74.97 79.97,76.97 78.97,78.97 79.97,80.97 79.97,84.97 79.97,88.97 80.97,2.97 81.97,4.97 80.97,6.97 81.97,48.97 80.97,50.97 81.97,52.97 80.97,54.97 81.97,56.97 80.97,58.97 81.97,60.97 80.97,62.97 81.97,64.97 80.97,66.97 81.97,68.97 80.97,70.97 81.97,72.97 80.97,74.97 81.97,76.97 80.97,78.97 81.97,80.97 80.97,82.97 81.97,84.97 80.97,86.97 81.97,88.97 82.97,2.97 83.97,4.97 82.97,6.97 83.97,8.97 83.97,12.97 83.97,16.97 82.97,50.97 82.97,54.97 82.97,58.97 82.97,62.97 82.97,66.97 82.97,70.97 83.97,72.97 82.97,74.97 83.97,76.97 82.97,78.97 83.97,80.97 82.97,82.97 83.97,84.97 82.97,86.97 83.97,88.97 84.97,2.97 85.97,4.97 84.97,6.97 85.97,8.97 84.97,10.97 85.97,12.97 84.97,14.97 85.97,16.97 84.97,18.97 85.97,72.97 84.97,74.97 85.97,76.97 84.97,78.97 85.97,80.97 84.97,82.97 85.97,84.97 84.97,86.97 85.97,88.97 86.97,10.97 87.97,12.97 86.97,14.97 87.97,16.97 86.97,18.97 87.97,72.97 86.97,74.97 87.97,76.97 86.97,78.97 88.97,10.97 89.97,12.97 88.97,14.97 89.97,16.97 88.97,18.97 89.97,72.97 88.97,74.97 89.97,76.97 88.97,78.97 90.97,10.97 91.97,12.97 90.97,14.97 91.97,16.97 90.97,18.97 91.97,20.97 90.97,22.97 91.97,24.97 90.97,26.97 91.97,28.97 90.97,30.97 91.97,32.97 90.97,34.97 91.97,36.97 90.97,38.97 91.97,40.97 90.97,42.97 91.97,44.97 90.97,46.97 91.97,48.97 90.97,50.97 91.97,52.97 90.97,54.97 91.97,56.97 90.97,58.97 91.97,60.97 90.97,62.97 91.97,64.97 90.97,66.97 91.97,68.97 90.97,70.97 91.97,72.97 90.97,74.97 91.97,76.97 90.97,78.97 92.97,10.97 93.97,12.97 92.97,14.97 93.97,16.97 92.97,18.97 93.97,20.97 92.97,22.97 93.97,24.97 92.97,26.97 93.97,28.97 92.97,30.97 93.97,32.97 92.97,34.97 93.97,36.97 92.97,38.97 93.97,40.97 92.97,42.97 93.97,44.97 92.97,46.97 93.97,48.97 92.97,50.97 93.97,52.97 92.97,54.97 93.97,56.97 92.97,58.97 93.97,60.97 92.97,62.97 93.97,64.97 92.97,66.97 93.97,68.97 92.97,70.97 93.97,72.97 92.97,74.97 93.97,76.97 92.97,78.97
  pour Top (isolate 0.406): 0,0 0,100 100,100 100,0
  pour Route2 (isolate 0.406): 0,0 0,100 100,100 100,0
  pour Route15 (isolate 0.406): 0,0 0,100 100,100 100,0
  pour Bottom (isolate 0.406): 0,0 0,100 100,100 100,0
  cutout Top: 18,62 18,49 78,49 78,62
L_GPIO0  (via drill 0.3 pad 0.45, 0.35)
  Top 0.127: 40.87,38.07 U1.35
  Top 0.254: v43.69,38.07 40.87,38.07
  Route15 0.127: 66,15 65.92,15 LED1.A
  Route15 0.254: v43.69,38.07 46.76,35 R7.2 66,30.55 66,15
  other vias: 70.45,35 65.9,15.02
L_GPIO1  (via drill 0.3 pad 0.45, 0.35)
  Top 0.254: v46.18,37.3 45.57,36.69 U1.36
  Route15 0.254: v46.18,37.3 49.2,37.3 49.5,37 69,37 70.5,38.5 70.5,39.95 R8.2 | v70,30 70,16.72 LED2.A
  Bottom 0.254: R8.2 71.53,38.92 71.53,31.53 v70,30
  other vias: 70.45,40 68.3,15.02
L_GPIO2  (via drill 0.3 pad 0.45, 0.35)
  Top 0.127: 46.56,35.42 46.5,35.42
  Top 0.254: U1.37 46.5,35.42 | v47.67,36.53 46.56,35.42
  Route15 0.254: v47.67,36.53 48.2,36 70.5,36 71.5,37 | 71.5,37 72.5,38 72.5,42.95 R9.2 | 71.5,37 71.5,15.92 LED3.A
  other vias: 70.45,45 70.6,15.02
L_GPIO3  (via drill 0.3 pad 0.45)
  Top 0.254: v43.94,34.01 43.8,34.15 U1.38
  Bottom 0.127: v43.94,34.01 44.2,33.75 44.2,28.93 54.1,19.02 75.83,19.02 JP4.7
L_GPIO4  (via drill 0.3 pad 0.45)
  Top 0.254: v43.18,32.74 43.03,32.88 U1.39
  Bottom 0.127: v43.18,32.74 43.43,32.48 43.43,28.67 53.85,18.26 77.61,18.26 JP4.6
L_GPIO5  (via drill 0.3 pad 0.45)
  Top 0.254: v42.67,31.47 42.53,31.61 U1.40
  Bottom 0.127: v42.67,31.47 42.67,28.16 53.34,17.5 79.39,17.5 JP4.5
L_GPIO6  (via drill 0.3 pad 0.45)
  Top 0.254: v42.67,26.89 41.76,27.8 U1.43
  Bottom 0.127: v42.67,26.89 52.83,16.73 81.16,16.73 JP4.4
L_GPIO7  (via drill 0.3 pad 0.45)
  Top 0.254: v42.67,25.88 42.02,26.53 U1.44
  Bottom 0.127: v42.67,25.88 52.58,15.97 79.66,15.97 JP4.3
L_GPIO8  (via drill 0.3 pad 0.45)
  Top 0.254: v42.67,24.86 42.27,25.26 U1.45
  Bottom 0.127: v42.67,24.86 56.32,11.21 80.72,11.21 JP4.2
L_GPIO9  (via drill 0.3 pad 0.45)
  Top 0.254: v42.67,23.85 42.53,23.99 U1.46
  Bottom 0.127: v42.67,23.85 56.57,9.95 80.6,9.95 JP4.1
L_GPIO10  (via drill 0.3 pad 0.45)
  Top 0.127: v61.21,39.09 58.69,39.09 U1.14
  Bottom 0.127: v61.21,39.09 55.12,39.09 54.36,38.32 54.36,21.56 56.13,19.78 74.05,19.78 JP4.8
L_GPIO11  (via drill 0.3 pad 0.45)
  Top 0.127: U1.13 61.07,37.96 v61.21,37.82
  Bottom 0.127: v61.21,37.82 56.13,37.82 55.12,36.8 55.12,21.81 56.39,20.54 72.27,20.54 JP4.9
L_GPIO12  (via drill 0.3 pad 0.45)
  Top 0.127: 58.6,34.1 U1.10
  Top 0.254: v61.21,34.01 58.69,34.01 58.6,34.1
  Bottom 0.127: v61.21,34.01 56.9,34.01 55.88,32.99 55.88,22.07 56.64,21.31 70.5,21.31 JP4.10
L_GPIO13  (via drill 0.3 pad 0.45)
  Top 0.254: v61.21,32.74 58.69,32.74 U1.9
  Bottom 0.127: v61.21,32.74 57.4,32.74 56.64,31.97 56.64,22.58 57.15,22.07 68.72,22.07 JP4.11
L_RX  (via drill 0.35)
  Top 0.254: U1.7 61.05,30.34 v61.17,30.45
  Route15 0.254: JP3.4 30.5,22.34 30.5,23.96 JP3.8 30.5,27.42 30.5,29.04 JP3.12 29.09,30.45 v61.17,30.45
L_TX  (via drill 0.3 pad 0.45)
  Top 0.127: U1.6 v61.21,29.07
  Route15 0.254: JP3.14 27.5,32.04 27.5,29.5 JP3.10 28.73,28.23 27.5,27 27.5,24.42 JP3.6 27.5,21.88 27.5,20 28.11,19.39 29.9,19.39 39.59,29.07 v61.21,29.07
N$1  (via drill 0.3 pad 0.45, 0.35)
  Top 0.127: U2.7 47.96,58.69 v47.24,59.41
  Top 0.254: v66.5,38.5 67,38 67,35.5 67.5,35 R7.1 R4.2
  Route15 0.254: v47.24,59.41 46.5,58.66 46.5,53 51,48.5 61.5,48.5 65,45 65,40 v66.5,38.5
N$2  (via drill 0.3 pad 0.45, 0.35)
  Top 0.127: U2.6 48.36,59.81 v48.01,60.17
  Top 0.254: v67,40 R8.1 R5.2
  Route15 0.254: v48.01,60.17 48.01,54.99 54,49 62,49 66,45 66,41 v67,40
N$3  (via drill 0.35)
  Top 0.254: U1.23 51,48.04 v51,45.94 | v62,45.94 62.12,46.05 R11.1
  Route15 0.254: v51,45.94 v62,45.94
N$4
  Top 1.016: JP1.9 JP1.11 JP1.12 JP1.10 JP1.9
N$5  (via drill 0.35)
  Top 0.254: v74.63,32.32 R1.2
  Route15 0.254: LED3.C 70.5,12.08 70.5,12 73,14.5 73,30 73,30.7 v74.63,32.32
  other vias: 70.6,12.18
N$6  (via drill 0.35)
  Route15 0.254: R2.2 75.5,33.95 75.5,15 71.5,11 69.48,11 LED2.C
  other vias: 74.45,35 68.3,12.18
N$7  (via drill 0.3 pad 0.45, 0.35)
  Top 0.127: U2.5 48.76,59.65 v49.28,60.17
  Top 0.254: v67,45 R9.1 R6.2
  Route15 0.254: v49.28,60.17 49.28,54.72 54.5,49.5 62.5,49.5 v67,45
N$9  (via drill 0.35)
  Top 0.254: v43,41.5 42.73,41.77 U1.32
  Bottom 0.254: R10.1 34.26,41.5 v43,41.5
  other vias: 33.5,40.74
N$11  (via drill 0.35)
  Route15 0.254: R3.2 76.5,35.45 76.5,14.5 72,10 68,10 65.9,12.1 LED1.C
  other vias: 74.45,37.5 65.9,12.18
PGC_INT  (via drill 0.35, 0.35 pad 0.8)
  Top 0.254: v77,45 79.73,42.27 JP4.14 | v43.94,45.18 43.07,44.31 U1.30
  Bottom 0.127: v43.94,45.18 44,45.18
  Bottom 0.254: v77,45 75.48,46.52 45.33,46.52 44,45.18
PGD_INT  (via drill 0.35 pad 0.8)
  Top 0.254: v43.43,43.66 42.82,43.04 U1.31
  Bottom 0.254: JP4.15 79.31,44.81 78.55,44.05 43.83,44.05 v43.43,43.66
RX0
  Top 0.406: JP3.13 25.92,33 17.8,33 JP1.24
RX1
  Top 0.406: JP3.9 19,28.23 17.77,28.23 17.49,28.23 JP1.28
RX2
  Top 0.406: JP3.5 18,23.15 17.49,23.15 JP1.32
TX0
  Top 0.406: JP3.11 18,30.77 17.49,30.77 JP1.26
TX1
  Top 0.406: JP3.7 18.19,25.69 17.49,25.69 JP1.30
TX2
  Top 0.406: JP3.3 18,20.61 17.49,20.61 JP1.34
UARTCTS  (via drill 0.3 pad 0.45)
  Top 0.254: v60.96,25.37 58.65,25.37 U1.3
  Bottom 0.127: v60.96,25.37 57.91,25.37 57.4,24.86 57.4,23.59 58.17,22.83 66.94,22.83 JP4.12
UARTRTS  (via drill 0.3 pad 0.45)
  Top 0.254: v60.96,23.59 60.56,23.99 U1.2
  Bottom 0.127: JP4.13 65.16,23.59 v60.96,23.59

### Text on the board
tPlace: JLCJLCJLCJLC | BOARD # / 1 2 3 4 | RAD | REV C
bPlace: 4 | 2 | 1 | 3
tNames: PGD | REG IN | PDC | RTS | 3.3V REG | CTS | 3.3V STACK | IO13 | RX0 | IO12 | TX0 | IO11 | RX1 | IO0 | IO1 | IO2 | IO10 | ANT1 | TX1 | ANT2 | IO3 | ANT3 | RX2 | IO4 | ANT4 | OPEN | TX2 | IO5 | 50 | N/A | IO6 | OFF | GND | IO7 | =0V | IO8 | =1.8V | IO9 | JP5